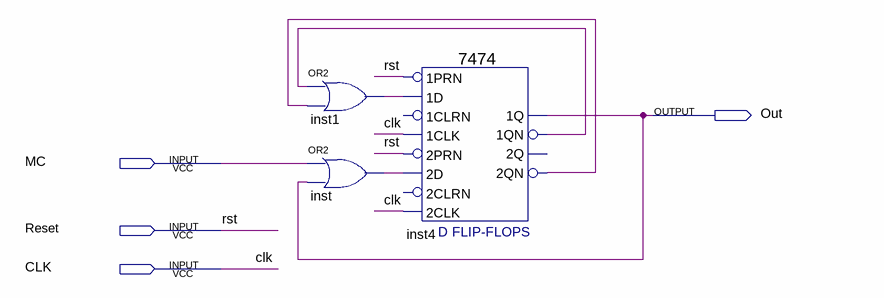
[diagram p0: schematic sheet]
// Quartus schematic CounterPart.bdf as structural Verilog: 3 symbols, 4 pins
module CounterPart (
  input  MC,
  input  Reset,
  input  CLK,
  output Out
);

  wire inst1_out, inst4_1qn, inst4_2qn, inst_out;

  or inst1 (inst1_out, inst4_1qn, inst4_2qn);
  or inst (inst_out, MC, Out);
  \7474  inst4 (
    .\2D (inst_out), .\2PRN (Reset), .\1CLK (CLK), .\1D (inst1_out), .\1PRN (Reset), .\2CLK (CLK),
    .\1QN (inst4_1qn), .\2QN (inst4_2qn), .\1Q (Out));  // open: 2CLRN, 1CLRN, 2Q

  // Other names for the same wires on the sheet: rst = Reset
endmodule
